# Altium schematic sheet 08_Mechanicals.SchDoc
size A; ApprovedDate: 04/02/2019; AssemblyNumber: ECE315-F19
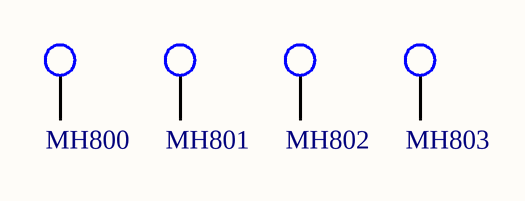
[diagram p0: 08_Mechanicals.SchDoc]

## Parts
MH800  MHOLE_2_55MM  [MHOLE_2_55MM]  (value not drawn)  (no BOM)
MH801  MHOLE_2_55MM  [MHOLE_2_55MM]  (value not drawn)  (no BOM)
MH802  MHOLE_2_55MM  [MHOLE_2_55MM]  (value not drawn)  (no BOM)
MH803  MHOLE_2_55MM  [MHOLE_2_55MM]  (value not drawn)  (no BOM)

## Nets

Not connected (* = marked no-connect by the designer): MH800 1; MH801 1; MH802 1; MH803 1

## Library data of the parts
MH800-MH803 = MHOLE_2_55MM: Mounting Holde; Manufacturer Part Number: UW MTHOLE